# Altium schematic sheet MCU.SchDoc
size Letter; SheetNumber: 2; SheetTotal: 4
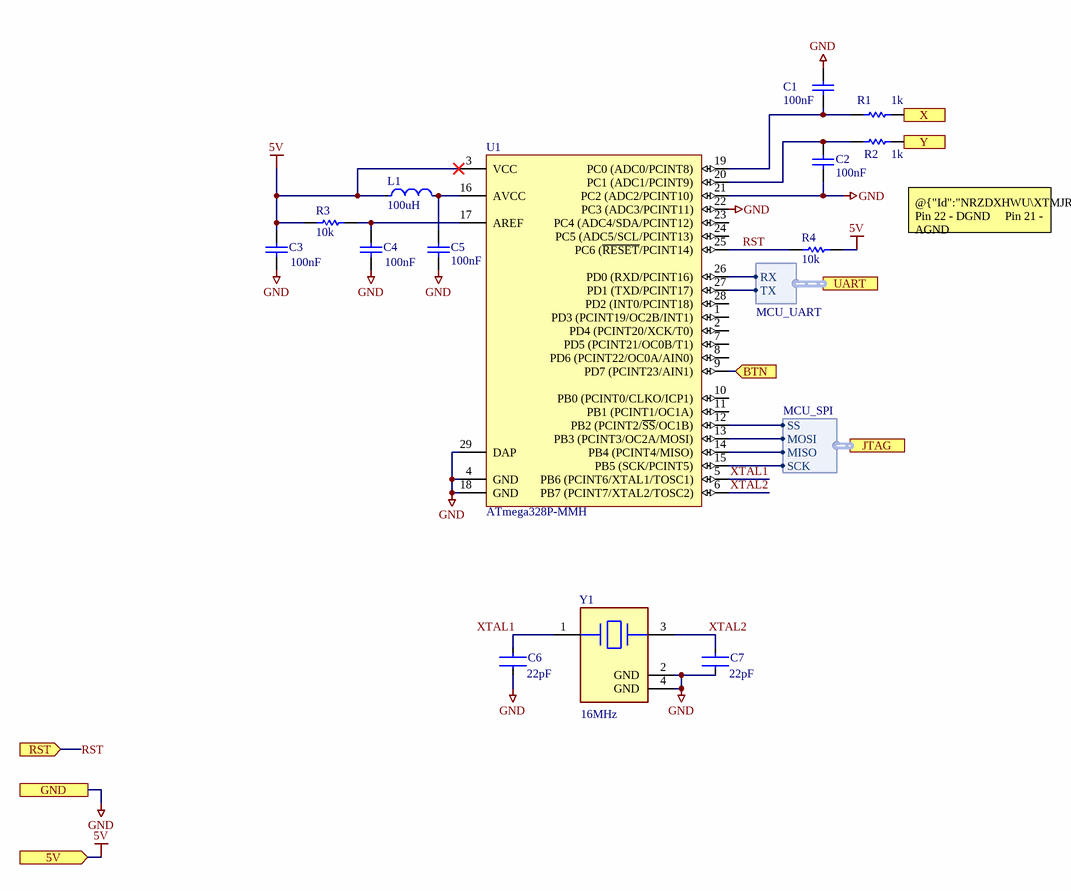
[diagram p0: MCU.SchDoc]

## Parts
C1  100nF  [CAPC1005X56X25ML10T15]
C2  100nF  [CAPC1005X56X25ML10T15]
C3  100nF  [CAPC1005X56X25ML10T15]
C4  100nF  [CAPC1005X56X25ML10T15]
C5  100nF  [CAPC1005X56X25ML10T15]
C6  C0805C220J5GACTU  [FP-C0805C-DN-MFG]  (value not drawn)
C7  C0805C220J5GACTU  [FP-C0805C-DN-MFG]  (value not drawn)
L1  100uH  [FP-CB3225-MFG]
R1  1k  [RESC1608X55X25ML10T15]
R2  1k  [RESC1608X55X25ML10T15]
R3  10k  [RESC1005X40X25LL05T05]
R4  10k  [RESC1005X40X25LL05T05]
U1  ATmega328P-MMH  [28M1_N]
Y1  ABM3B-16.000MHZ-10-1-U-T  [FP-ABM3B-MFG]  (value not drawn)

## Ports
5V (in), BTN (in), GND, JTAG (harness MCU_SPI), RST (in), UART (harness MCU_UART), X (in), Y (in)

## Harnesses
MCU_UART: RX, TX
MCU_SPI: MISO, SCK, MOSI, SS

## Nets
5V: C3.2 L1.1 R3.2 R4.1 U1.3(VCC) ; port 5V
GND: C1.2 C2.2 C3.1 C4.1 C5.2 C6.2 C7.2 U1.4(GND) U1.18(GND) U1.21(PC2_(ADC2/PCINT10)) U1.22(PC3_(ADC3/PCINT11)) U1.29(DAP) Y1.2(GND) Y1.4(GND) ; port GND
BTN: U1.9(PD7_(PCINT23/AIN1)) ; port BTN
RST: R4.2 U1.25(PC6_(~{RESET}/PCINT14)) ; port RST
X: R1.2 ; port X
XTAL1: C6.1 U1.5(PB6_(PCINT6/XTAL1/TOSC1)) Y1.1
XTAL2: C7.1 U1.6(PB7_(PCINT7/XTAL2/TOSC2)) Y1.3
Y: R2.2 ; port Y
NetC1_1: C1.1 R1.1 U1.19(PC0_(ADC0/PCINT8))
NetC2_1: C2.1 R2.1 U1.20(PC1_(ADC1/PCINT9))
NetC4_2: C4.2 R3.1 U1.17(AREF)
NetC5_1: C5.1 L1.2 U1.16(AVCC)
NetU1_12: U1.12(PB2_(PCINT2/~{SS}/OC1B)) ; port JTAG.SS
NetU1_13: U1.13(PB3_(PCINT3/OC2A/MOSI)) ; port JTAG.MOSI
NetU1_14: U1.14(PB4_(PCINT4/MISO)) ; port JTAG.MISO
NetU1_15: U1.15(PB5_(SCK/PCINT5)) ; port JTAG.SCK
NetU1_26: U1.26(PD0_(RXD/PCINT16)) ; port UART.RX
NetU1_27: U1.27(PD1_(TXD/PCINT17)) ; port UART.TX

Not connected (* = marked no-connect by the designer): U1 1(PD3_(PCINT19/OC2B/INT1)) 2(PD4_(PCINT20/XCK/T0)) 7(PD5_(PCINT21/OC0B/T1)) 8(PD6_(PCINT22/OC0A/AIN0)) 10(PB0_(PCINT0/CLKO/ICP1)) 11(PB1_(PCINT1/OC1A)) 23(PC4_(ADC4/SDA/PCINT12)) 24(PC5_(ADC5/SCL/PCINT13)) 28(PD2_(INT0/PCINT18))

## Notes on the sheet
- @{"Id":"NRZDXHWU\XTMJRJYD"} Pin 22 - DGND     Pin 21 - AGND
- (near C6) 22pF
- (near C7) 22pF
- (near Y1) 16MHz
- SHEET
- REVISION
- OF
- PROJECT
- REVIEWER
- ENGINEER
- DATE

## Library data of the parts
C1-C5 = CMP-1034-02071-2: Manufacturer: AVX Interconnect / Elco; Part Number: 0402YG104ZAT2A
C6 C7 = CMP-2007-00048-2: Capacitor; Ceramic; Cap; 22.0pF; Tol 5%; SMT; Vol-Rtg 50V; C0G; Tape and Reel; Manufacturer: KEMET; Temperature Coefficient: 30ppm/°C; Capacitance: 22 pF; Value: 22 pF; Tolerance: 0.05; Device Class L1: Passive Components; Mouser Description: Multilayer Ceramic Capacitors MLCC - SMD/SMT 50volts 22pF C0G 5%; Temperature Range Low: -55°C; Automotive: No; Voltage Rating: 50 V; Material: Ceramic; Category: Cap; Height: 0.88mm; Temperature Range High: +125°C; Digikey Description: Capacitor; Ceramic; Cap; 22.0pF; Tol 5%; SMT; Vol-Rtg 50V; C0G; Tape and Reel; Octopart: https://octopart.com/c0805c220j5gactu-kemet-145470; ComponentLink2Description: Datasheet; Device Class L2: Capacitors; Ipc Land Pattern Name: CAPC200125X78; RoHS: TRUE; ComponentLink2URL: https://content.kemet.com/datasheets/KEM_C1003_C0G_SMD.pdf; Temperature: -55°C to +125°C; Device Class L3: Ceramic Capacitors; Lead Free: Yes; Manufacturer Part Number: C0805C220J5GACTU; Temperature Characteristic: C0G; Package: C0805C-DN
L1 = CMP-14484-000373-1: SMD Inductors 100uH ±20% 0.34A 1.82Ω 1210; Resistance: 1.4R; DC Current: 340mA; DC Resistance (DCR): 1.82R; Saturation Current: 270mA; Self Resonant Frequency: 6MHz; Core Material: Ferrite; Inductor Type: POWER; Shielding: Unshielded; Test Frequency: 100kHz; Max Operating Temperature: 105°C; Length: 0.126inch; Inductance: 100uH; Current Rating: 340mA; Resistor Type: Wirewound; Halogen Free: Halogen Free; Height - Seated (Max): 0.106inch; Case/Package: 1210; Package Quantity: 1000; Lead Free: Lead Free; Series: CB; Tolerance: 20%; Depth: 2.7mm; Number of Pins: 2; Width: 0.098inch; Termination: SMD/SMT; Min Operating Temperature: -40°C; Max DC Current: 340mA; Inductance Tolerance: 20%; Radiation Hardening: No; Military Standard: Not; Height: 2.5mm; Case Code (Metric): 3225; Packaging: Tape and Reel; Mount: Surface Mount; RoHS Compliant: Yes; Case Code (Imperial): 1210
R1 R2 = CMP-2000-04525-1: Part Number: RT0603BRE071KL; Manufacturer: Yageo
R3 R4 = CMP-2000-07588-1: Chip Resistor, 10 KOhm, +/- 1%, 0.1 W, -55 to 155 degC, 0402 (1005 Metric), RoHS, Tape and Reel; Manufacturer: Panasonic; Power Rating: 100mW; Voltage Rating: 50V; Resistance: 10KOhm; Case\/Package: 0402; Temperature Coefficient: 100ppm\/degreesC; RoHSCompliant: True; Lead Free: LeadFree; Package Quantity: 1; Contact Plating: Tin; Length: 1mm; Radiation Hardening: No; REACH SVHC: NoSVHC; Max Operating Temperature: 155degC; Depth: 0.5mm; Case Code (Imperial): 0402; Military Standard: Not; Package Description: 2-Pin Surface Mount Device, Body 1 x 0.5 mm; Termination: SMD/SMT; Case Code (Metric): 1005; Height: 0.35mm; Packaging: TapeandReel; Voltage Rating (DC): 50V; Package Reference: 402; Number of Pins: 2; Tolerance: 1%; Mounting Technology: SurfaceMount; Width: 0.02inch; Mount: SurfaceMount; Datasheet URL: https://industrial.panasonic.com/cdbs/www-data/pdf/RDA0000/AOA0000C304.pdf; Composition: ThickFilm; Datasheet Version: 02/2017; Manufacturer URL: http://www.panasonic.com/; Max Power Dissipation: 100mW; Number of Terminations: 2; Min Operating Temperature: -55degC
U1 = CMP-0095-00378-1: 8-bit AVR Microcontroller, 32KB Flash, 1KB EEPROM, 2KB SRAM, 28-pin VQFN, Industrial Grade (-40°C to 85°C); ComponentLink2URL: http://www.atmel.com/dyn/resources/prod_documents/8271.pdf; ComponentLink2Description: ATmega48A/48PA/88A/88PA/168A/168PA/328/328P Datasheet; PackageReference: 28M1; ComponentLink3URL: http://www.atmel.com/dyn/resources/prod_documents/8271S.pdf; ComponentLink3Description: ATmega48A/48PA/88A/88PA/168A/168PA/328/328P Summary; PackageVersion: revB, Nov-2008; DatasheetVersion: revD, May-2011; PackageDescription: 28-pad, 4x4x1.0mm Body, Pitch 0.45mm, 2.4x2.4mm Exposed Pad, Plastic Very Thin QFN Package (VQFN); ComponentLink1URL: http://www.atmel.com/; ComponentLink1Description: Manufacturer URL
Y1 = CMP-27762-009701-1: Crystal 16MHz ±10ppm 10pF SMD-4 5mm x 3.2mm; Series Resistance: 50R; Package Quantity: 1000; Resistor Type: Ceramic; REACH SVHC: No SVHC; Load Capacitance: 10pF; Min Operating Temperature: -10°C; Depth: 3.2mm; ESR (Equivalent Series Resistance): 50R; Length: 5mm; Number of Pins: 4; Packaging: Tape and Reel; Tolerance: 10ppm; Operating Frequency: 16 MHz; Series: ABM3B; Frequency Stability: 10ppm; Height: 0.043inch; Lead Free: Lead Free; Case/Package: CSMD; Frequency: 16MHz; Max Operating Temperature: 60°C; Frequency Tolerance: 10ppm; Termination: SMD/SMT; Width: 3.2mm; Mount: Surface Mount